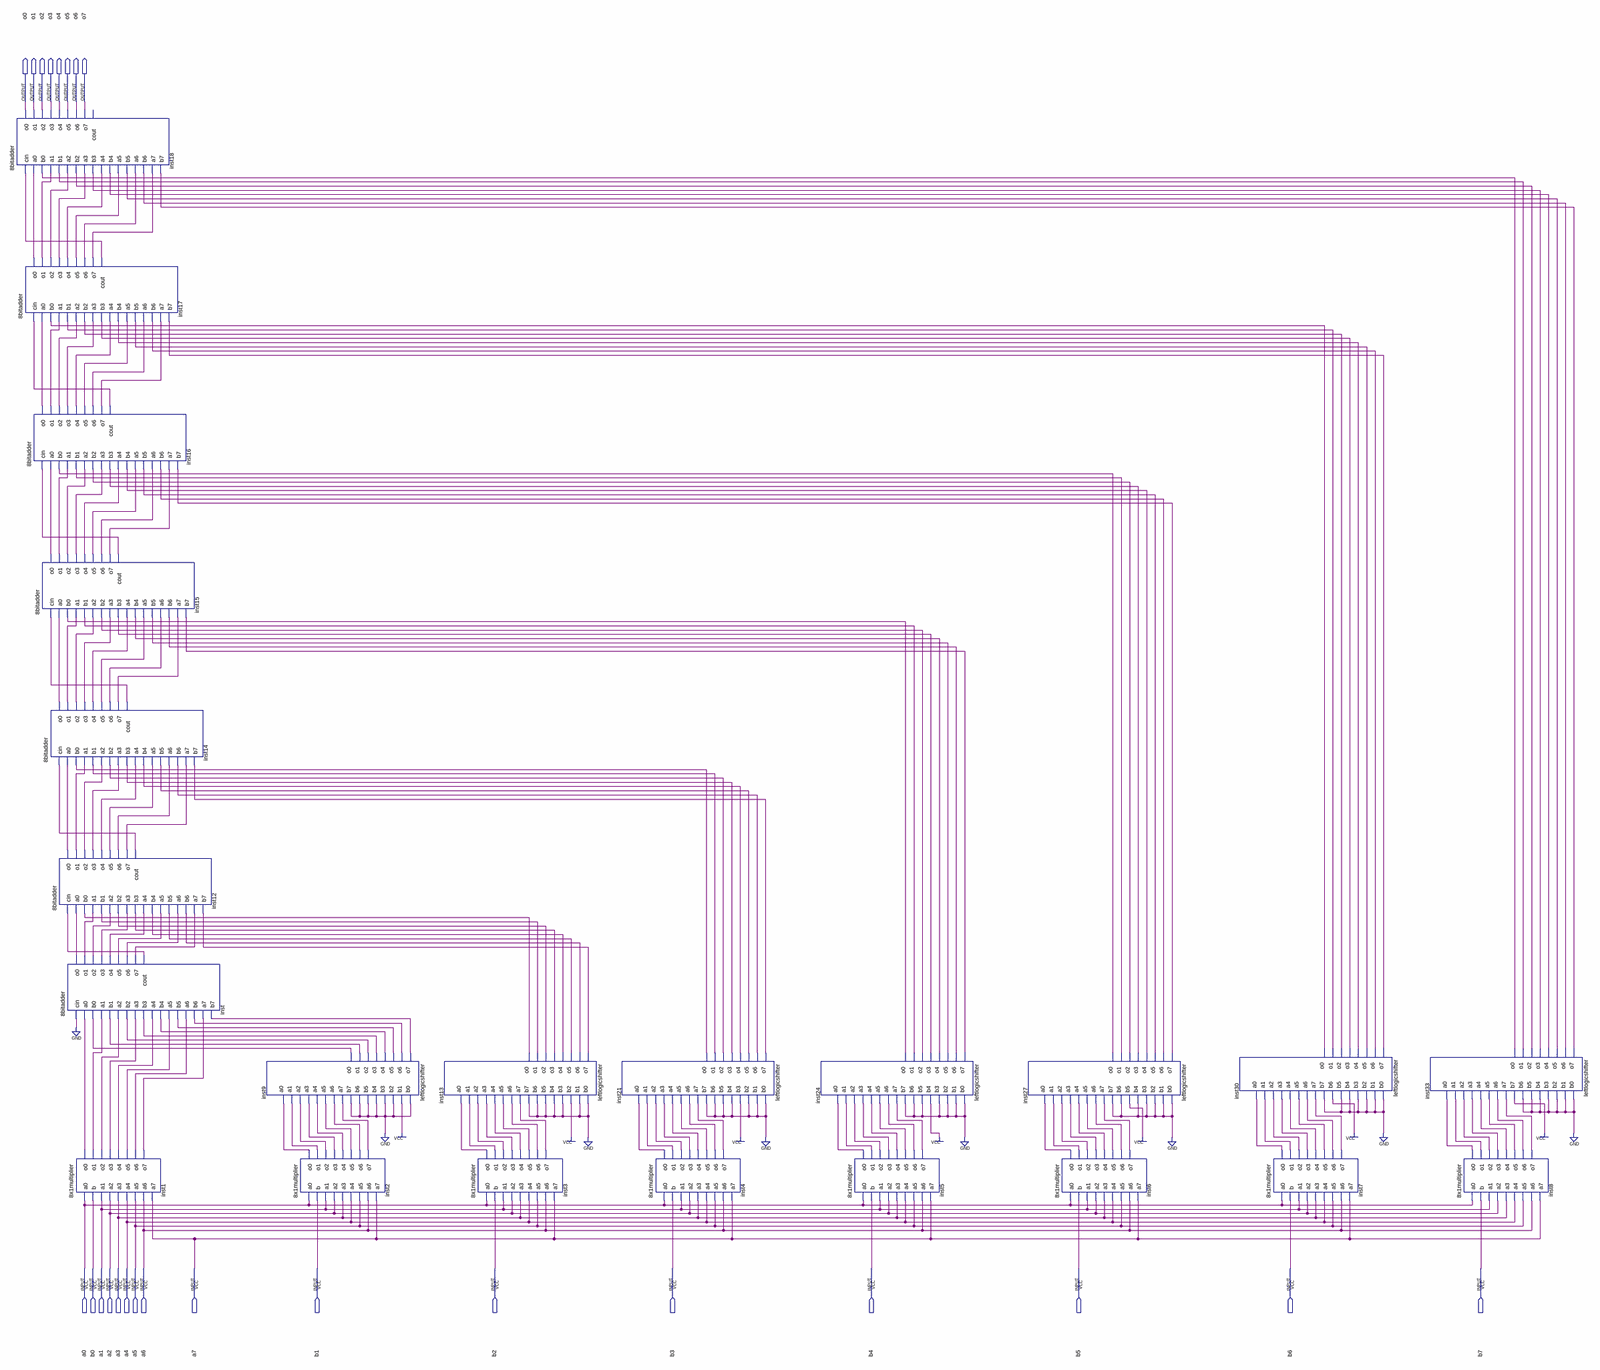
[diagram p0: schematic sheet, whole]
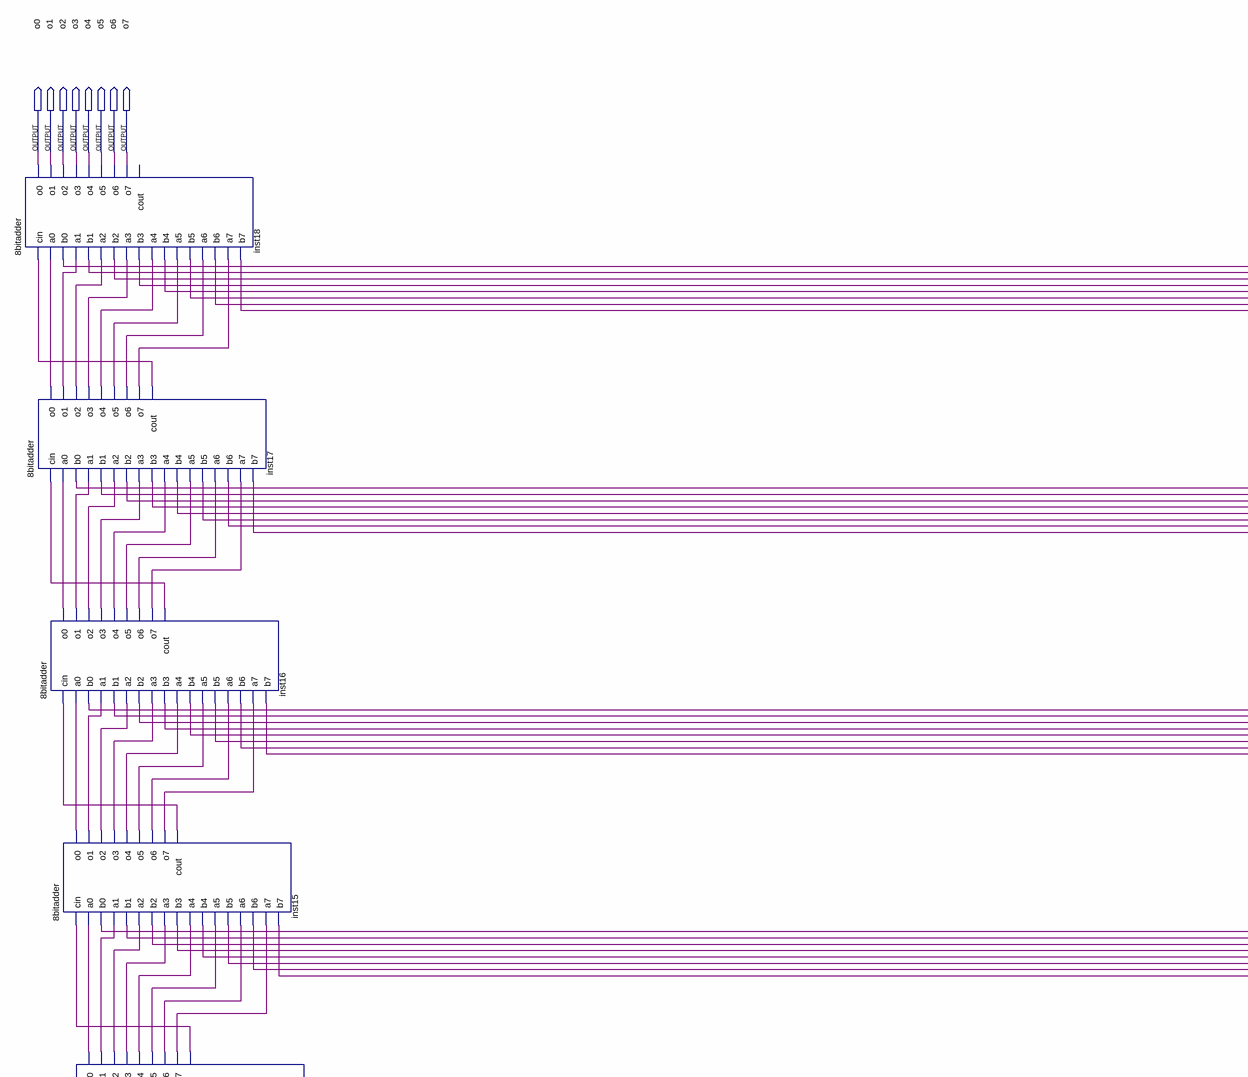
[diagram p1: schematic sheet, upper left part]
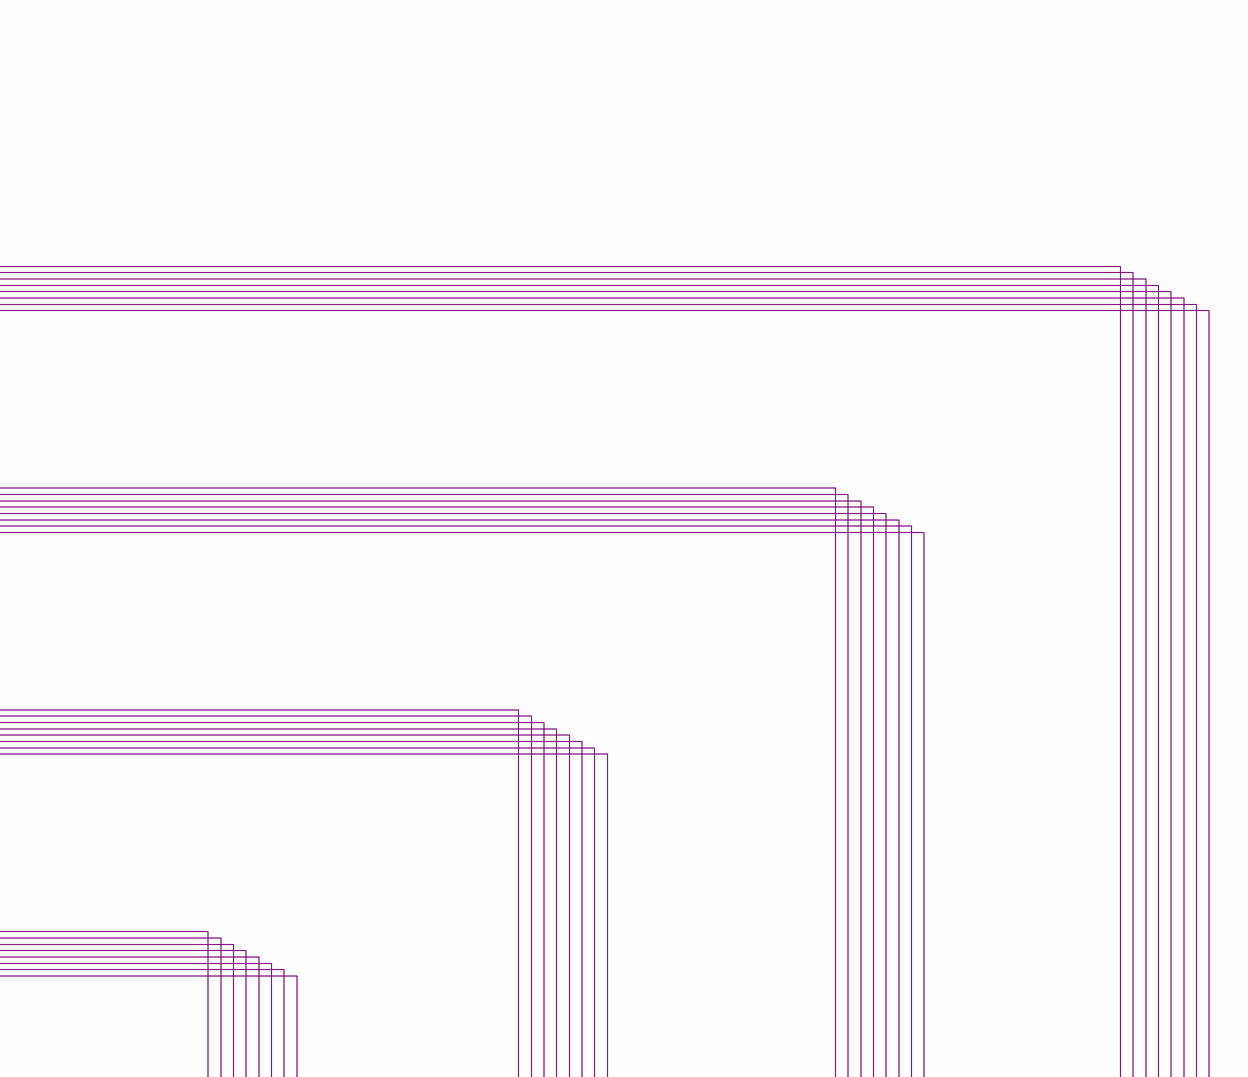
[diagram p2: schematic sheet, upper right part]
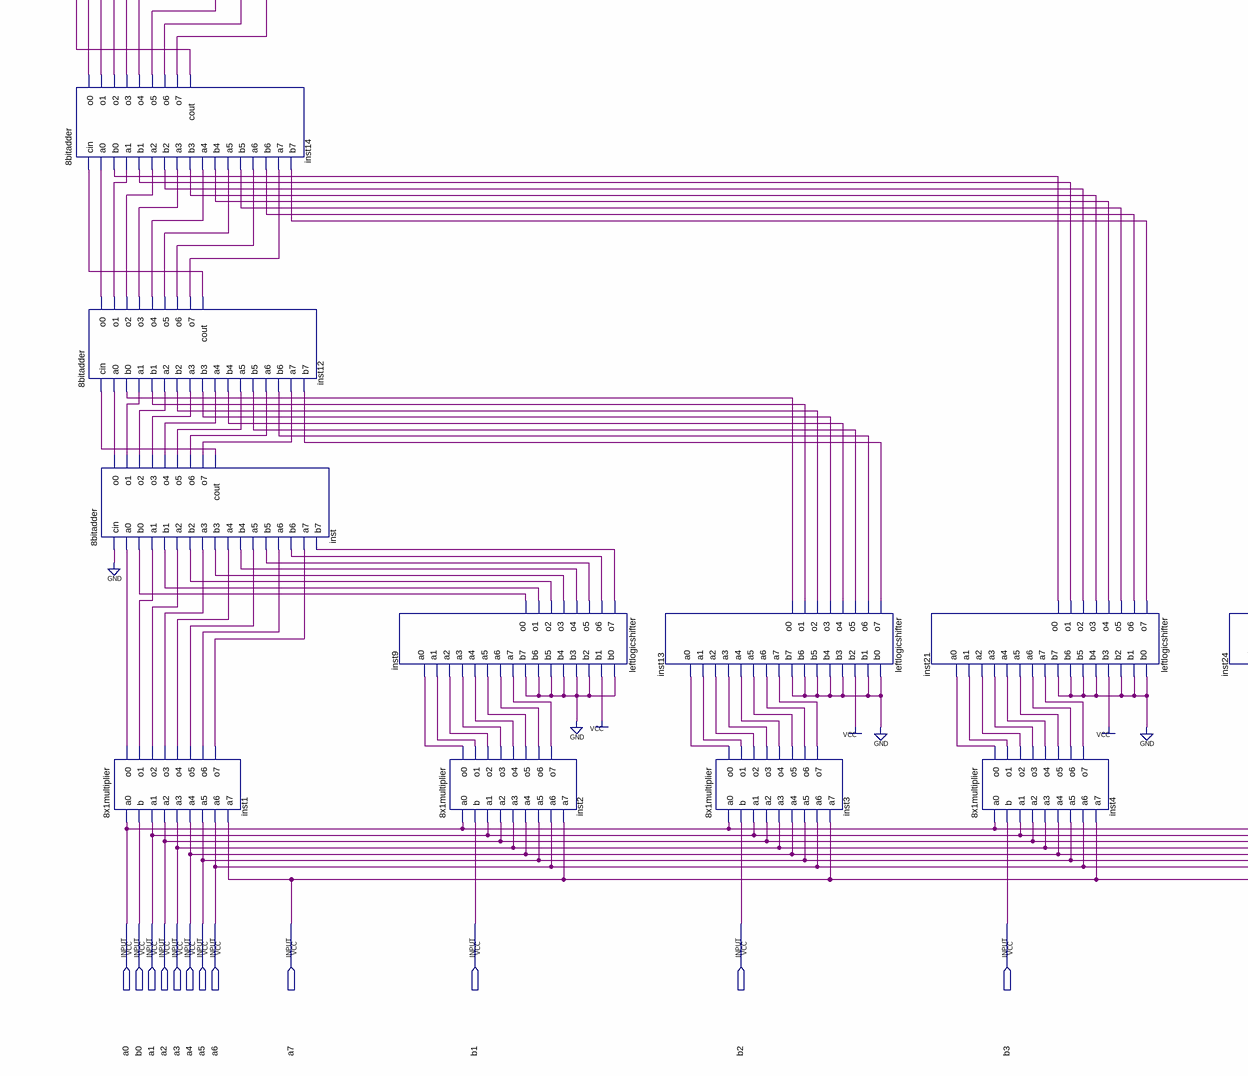
[diagram p3: schematic sheet, lower left part]
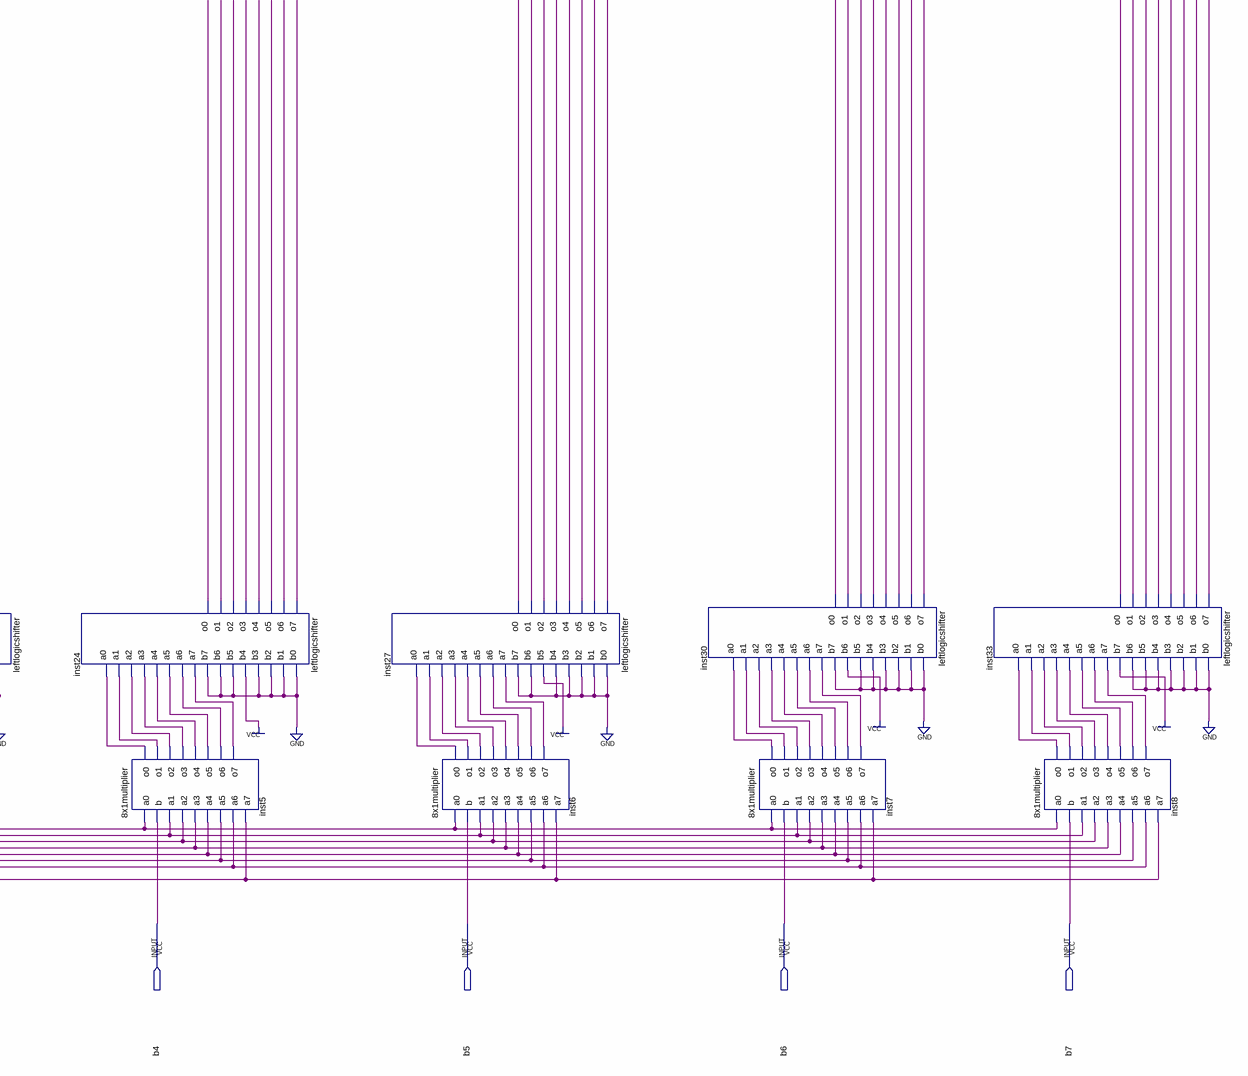
[diagram p4: schematic sheet, lower right part]
// Quartus schematic 8x8multiplier.bdf as structural Verilog: 22 symbols, 24 pins
module \8x8multiplier  (
  input  a0,
  input  b0,
  input  a1,
  input  a2,
  input  a3,
  input  a4,
  input  a5,
  input  a6,
  input  a7,
  input  b1,
  input  b2,
  input  b3,
  input  b4,
  input  b5,
  input  b6,
  input  b7,
  output o0,
  output o1,
  output o2,
  output o3,
  output o4,
  output o5,
  output o6,
  output o7
);

  wire inst1_o0, inst1_o1, inst1_o2, inst1_o3, inst1_o4, inst1_o5, inst1_o6, inst1_o7, inst2_o0, inst2_o1,
       inst2_o2, inst2_o3, inst2_o4, inst2_o5, inst2_o6, inst2_o7, inst3_o0, inst3_o1, inst3_o2, inst3_o3,
       inst3_o4, inst3_o5, inst3_o6, inst3_o7, inst4_o0, inst4_o1, inst4_o2, inst4_o3, inst4_o4, inst4_o5,
       inst4_o6, inst4_o7, inst5_o0, inst5_o1, inst5_o2, inst5_o3, inst5_o4, inst5_o5, inst5_o6, inst5_o7,
       inst6_o0, inst6_o1, inst6_o2, inst6_o3, inst6_o4, inst6_o5, inst6_o6, inst6_o7, inst7_o0, inst7_o1,
       inst7_o2, inst7_o3, inst7_o4, inst7_o5, inst7_o6, inst7_o7, inst8_o0, inst8_o1, inst8_o2, inst8_o3,
       inst8_o4, inst8_o5, inst8_o6, inst8_o7, inst9_o0, inst9_o1, inst9_o2, inst9_o3, inst9_o4, inst9_o5,
       inst9_o6, inst9_o7, inst12_cout, inst12_o0, inst12_o1, inst12_o2, inst12_o3, inst12_o4, inst12_o5,
       inst12_o6, inst12_o7, inst13_o0, inst13_o1, inst13_o2, inst13_o3, inst13_o4, inst13_o5, inst13_o6,
       inst13_o7, inst14_cout, inst14_o0, inst14_o1, inst14_o2, inst14_o3, inst14_o4, inst14_o5, inst14_o6,
       inst14_o7, inst15_cout, inst15_o0, inst15_o1, inst15_o2, inst15_o3, inst15_o4, inst15_o5, inst15_o6,
       inst15_o7, inst16_cout, inst16_o0, inst16_o1, inst16_o2, inst16_o3, inst16_o4, inst16_o5, inst16_o6,
       inst16_o7, inst17_cout, inst17_o0, inst17_o1, inst17_o2, inst17_o3, inst17_o4, inst17_o5, inst17_o6,
       inst17_o7, inst21_o0, inst21_o1, inst21_o2, inst21_o3, inst21_o4, inst21_o5, inst21_o6, inst21_o7,
       inst24_o0, inst24_o1, inst24_o2, inst24_o3, inst24_o4, inst24_o5, inst24_o6, inst24_o7, inst27_o0,
       inst27_o1, inst27_o2, inst27_o3, inst27_o4, inst27_o5, inst27_o6, inst27_o7, inst30_o0, inst30_o1,
       inst30_o2, inst30_o3, inst30_o4, inst30_o5, inst30_o6, inst30_o7, inst33_o0, inst33_o1, inst33_o2,
       inst33_o3, inst33_o4, inst33_o5, inst33_o6, inst33_o7, inst_cout, inst_o0, inst_o1, inst_o2, inst_o3,
       inst_o4, inst_o5, inst_o6, inst_o7;

  \8bitadder  inst18 (
    .cin(inst17_cout), .a0(inst17_o0), .b0(inst33_o0), .a1(inst17_o1), .b1(inst33_o1), .a2(inst17_o2),
    .b2(inst33_o2), .a3(inst17_o3), .b3(inst33_o3), .a4(inst17_o4), .b4(inst33_o4), .a5(inst17_o5),
    .b5(inst33_o5), .a6(inst17_o6), .b6(inst33_o6), .a7(inst17_o7), .b7(inst33_o7), .o0(o0), .o1(o1),
    .o2(o2), .o3(o3), .o4(o4), .o5(o5), .o6(o6), .o7(o7));  // open: cout
  \8bitadder  inst17 (
    .cin(inst16_cout), .a0(inst16_o0), .b0(inst30_o0), .a1(inst16_o1), .b1(inst30_o1), .a2(inst16_o2),
    .b2(inst30_o2), .a3(inst16_o3), .b3(inst30_o3), .a4(inst16_o4), .b4(inst30_o4), .a5(inst16_o5),
    .b5(inst30_o5), .a6(inst16_o6), .b6(inst30_o6), .a7(inst16_o7), .b7(inst30_o7), .o0(inst17_o0),
    .o1(inst17_o1), .o2(inst17_o2), .o3(inst17_o3), .o4(inst17_o4), .o5(inst17_o5), .o6(inst17_o6),
    .o7(inst17_o7), .cout(inst17_cout));
  \8bitadder  inst16 (
    .cin(inst15_cout), .a0(inst15_o0), .b0(inst27_o0), .a1(inst15_o1), .b1(inst27_o1), .a2(inst15_o2),
    .b2(inst27_o2), .a3(inst15_o3), .b3(inst27_o3), .a4(inst15_o4), .b4(inst27_o4), .a5(inst15_o5),
    .b5(inst27_o5), .a6(inst15_o6), .b6(inst27_o6), .a7(inst15_o7), .b7(inst27_o7), .o0(inst16_o0),
    .o1(inst16_o1), .o2(inst16_o2), .o3(inst16_o3), .o4(inst16_o4), .o5(inst16_o5), .o6(inst16_o6),
    .o7(inst16_o7), .cout(inst16_cout));
  \8bitadder  inst15 (
    .cin(inst14_cout), .a0(inst14_o0), .b0(inst24_o0), .a1(inst14_o1), .b1(inst24_o1), .a2(inst14_o2),
    .b2(inst24_o2), .a3(inst14_o3), .b3(inst24_o3), .a4(inst14_o4), .b4(inst24_o4), .a5(inst14_o5),
    .b5(inst24_o5), .a6(inst14_o6), .b6(inst24_o6), .a7(inst14_o7), .b7(inst24_o7), .o0(inst15_o0),
    .o1(inst15_o1), .o2(inst15_o2), .o3(inst15_o3), .o4(inst15_o4), .o5(inst15_o5), .o6(inst15_o6),
    .o7(inst15_o7), .cout(inst15_cout));
  \8bitadder  inst14 (
    .cin(inst12_cout), .a0(inst12_o0), .b0(inst21_o0), .a1(inst12_o1), .b1(inst21_o1), .a2(inst12_o2),
    .b2(inst21_o2), .a3(inst12_o3), .b3(inst21_o3), .a4(inst12_o4), .b4(inst21_o4), .a5(inst12_o5),
    .b5(inst21_o5), .a6(inst12_o6), .b6(inst21_o6), .a7(inst12_o7), .b7(inst21_o7), .o0(inst14_o0),
    .o1(inst14_o1), .o2(inst14_o2), .o3(inst14_o3), .o4(inst14_o4), .o5(inst14_o5), .o6(inst14_o6),
    .o7(inst14_o7), .cout(inst14_cout));
  \8bitadder  inst12 (
    .cin(inst_cout), .a0(inst_o0), .b0(inst13_o0), .a1(inst_o1), .b1(inst13_o1), .a2(inst_o2),
    .b2(inst13_o2), .a3(inst_o3), .b3(inst13_o3), .a4(inst_o4), .b4(inst13_o4), .a5(inst_o5), .b5(inst13_o5),
    .a6(inst_o6), .b6(inst13_o6), .a7(inst_o7), .b7(inst13_o7), .o0(inst12_o0), .o1(inst12_o1),
    .o2(inst12_o2), .o3(inst12_o3), .o4(inst12_o4), .o5(inst12_o5), .o6(inst12_o6), .o7(inst12_o7),
    .cout(inst12_cout));
  \8bitadder  inst (
    .cin(1'b0), .a0(inst1_o0), .b0(inst9_o0), .a1(inst1_o1), .b1(inst9_o1), .a2(inst1_o2), .b2(inst9_o2),
    .a3(inst1_o3), .b3(inst9_o3), .a4(inst1_o4), .b4(inst9_o4), .a5(inst1_o5), .b5(inst9_o5), .a6(inst1_o6),
    .b6(inst9_o6), .a7(inst1_o7), .b7(inst9_o7), .o0(inst_o0), .o1(inst_o1), .o2(inst_o2), .o3(inst_o3),
    .o4(inst_o4), .o5(inst_o5), .o6(inst_o6), .o7(inst_o7), .cout(inst_cout));
  \8x1multiplier  inst1 (
    .a0(a0), .b(b0), .a1(a1), .a2(a2), .a3(a3), .a4(a4), .a5(a5), .a6(a6), .a7(a7), .o0(inst1_o0),
    .o1(inst1_o1), .o2(inst1_o2), .o3(inst1_o3), .o4(inst1_o4), .o5(inst1_o5), .o6(inst1_o6), .o7(inst1_o7));
  leftlogicshifter inst9 (
    .b0(1'b0), .b1(1'b1), .b2(1'b0), .b3(1'b0), .b4(1'b0), .b5(1'b0), .b6(1'b0), .b7(1'b0), .a7(inst2_o7),
    .a6(inst2_o6), .a5(inst2_o5), .a4(inst2_o4), .a3(inst2_o3), .a2(inst2_o2), .a1(inst2_o1), .a0(inst2_o0),
    .o7(inst9_o7), .o6(inst9_o6), .o5(inst9_o5), .o4(inst9_o4), .o3(inst9_o3), .o2(inst9_o2), .o1(inst9_o1),
    .o0(inst9_o0));
  \8x1multiplier  inst2 (
    .a0(a0), .b(b1), .a1(a1), .a2(a2), .a3(a3), .a4(a4), .a5(a5), .a6(a6), .a7(a7), .o0(inst2_o0),
    .o1(inst2_o1), .o2(inst2_o2), .o3(inst2_o3), .o4(inst2_o4), .o5(inst2_o5), .o6(inst2_o6), .o7(inst2_o7));
  leftlogicshifter inst13 (
    .b0(1'b0), .b1(1'b0), .b2(1'b1), .b3(1'b0), .b4(1'b0), .b5(1'b0), .b6(1'b0), .b7(1'b0), .a7(inst3_o7),
    .a6(inst3_o6), .a5(inst3_o5), .a4(inst3_o4), .a3(inst3_o3), .a2(inst3_o2), .a1(inst3_o1), .a0(inst3_o0),
    .o7(inst13_o7), .o6(inst13_o6), .o5(inst13_o5), .o4(inst13_o4), .o3(inst13_o3), .o2(inst13_o2),
    .o1(inst13_o1), .o0(inst13_o0));
  \8x1multiplier  inst3 (
    .a0(a0), .b(b2), .a1(a1), .a2(a2), .a3(a3), .a4(a4), .a5(a5), .a6(a6), .a7(a7), .o0(inst3_o0),
    .o1(inst3_o1), .o2(inst3_o2), .o3(inst3_o3), .o4(inst3_o4), .o5(inst3_o5), .o6(inst3_o6), .o7(inst3_o7));
  leftlogicshifter inst21 (
    .b0(1'b0), .b1(1'b0), .b2(1'b0), .b3(1'b1), .b4(1'b0), .b5(1'b0), .b6(1'b0), .b7(1'b0), .a7(inst4_o7),
    .a6(inst4_o6), .a5(inst4_o5), .a4(inst4_o4), .a3(inst4_o3), .a2(inst4_o2), .a1(inst4_o1), .a0(inst4_o0),
    .o7(inst21_o7), .o6(inst21_o6), .o5(inst21_o5), .o4(inst21_o4), .o3(inst21_o3), .o2(inst21_o2),
    .o1(inst21_o1), .o0(inst21_o0));
  \8x1multiplier  inst4 (
    .a0(a0), .b(b3), .a1(a1), .a2(a2), .a3(a3), .a4(a4), .a5(a5), .a6(a6), .a7(a7), .o0(inst4_o0),
    .o1(inst4_o1), .o2(inst4_o2), .o3(inst4_o3), .o4(inst4_o4), .o5(inst4_o5), .o6(inst4_o6), .o7(inst4_o7));
  leftlogicshifter inst24 (
    .b0(1'b0), .b1(1'b0), .b2(1'b0), .b3(1'b0), .b4(1'b1), .b5(1'b0), .b6(1'b0), .b7(1'b0), .a7(inst5_o7),
    .a6(inst5_o6), .a5(inst5_o5), .a4(inst5_o4), .a3(inst5_o3), .a2(inst5_o2), .a1(inst5_o1), .a0(inst5_o0),
    .o7(inst24_o7), .o6(inst24_o6), .o5(inst24_o5), .o4(inst24_o4), .o3(inst24_o3), .o2(inst24_o2),
    .o1(inst24_o1), .o0(inst24_o0));
  \8x1multiplier  inst5 (
    .a0(a0), .b(b4), .a1(a1), .a2(a2), .a3(a3), .a4(a4), .a5(a5), .a6(a6), .a7(a7), .o0(inst5_o0),
    .o1(inst5_o1), .o2(inst5_o2), .o3(inst5_o3), .o4(inst5_o4), .o5(inst5_o5), .o6(inst5_o6), .o7(inst5_o7));
  leftlogicshifter inst27 (
    .b0(1'b0), .b1(1'b0), .b2(1'b0), .b3(1'b0), .b4(1'b0), .b5(1'b1), .b6(1'b0), .b7(1'b0), .a7(inst6_o7),
    .a6(inst6_o6), .a5(inst6_o5), .a4(inst6_o4), .a3(inst6_o3), .a2(inst6_o2), .a1(inst6_o1), .a0(inst6_o0),
    .o7(inst27_o7), .o6(inst27_o6), .o5(inst27_o5), .o4(inst27_o4), .o3(inst27_o3), .o2(inst27_o2),
    .o1(inst27_o1), .o0(inst27_o0));
  \8x1multiplier  inst6 (
    .a0(a0), .b(b5), .a1(a1), .a2(a2), .a3(a3), .a4(a4), .a5(a5), .a6(a6), .a7(a7), .o0(inst6_o0),
    .o1(inst6_o1), .o2(inst6_o2), .o3(inst6_o3), .o4(inst6_o4), .o5(inst6_o5), .o6(inst6_o6), .o7(inst6_o7));
  leftlogicshifter inst30 (
    .b0(1'b0), .b1(1'b0), .b2(1'b0), .b3(1'b0), .b4(1'b0), .b5(1'b0), .b6(1'b1), .b7(1'b0), .a7(inst7_o7),
    .a6(inst7_o6), .a5(inst7_o5), .a4(inst7_o4), .a3(inst7_o3), .a2(inst7_o2), .a1(inst7_o1), .a0(inst7_o0),
    .o7(inst30_o7), .o6(inst30_o6), .o5(inst30_o5), .o4(inst30_o4), .o3(inst30_o3), .o2(inst30_o2),
    .o1(inst30_o1), .o0(inst30_o0));
  \8x1multiplier  inst7 (
    .a0(a0), .b(b6), .a1(a1), .a2(a2), .a3(a3), .a4(a4), .a5(a5), .a6(a6), .a7(a7), .o0(inst7_o0),
    .o1(inst7_o1), .o2(inst7_o2), .o3(inst7_o3), .o4(inst7_o4), .o5(inst7_o5), .o6(inst7_o6), .o7(inst7_o7));
  leftlogicshifter inst33 (
    .b0(1'b0), .b1(1'b0), .b2(1'b0), .b3(1'b0), .b4(1'b0), .b5(1'b0), .b6(1'b0), .b7(1'b1), .a7(inst8_o7),
    .a6(inst8_o6), .a5(inst8_o5), .a4(inst8_o4), .a3(inst8_o3), .a2(inst8_o2), .a1(inst8_o1), .a0(inst8_o0),
    .o7(inst33_o7), .o6(inst33_o6), .o5(inst33_o5), .o4(inst33_o4), .o3(inst33_o3), .o2(inst33_o2),
    .o1(inst33_o1), .o0(inst33_o0));
  \8x1multiplier  inst8 (
    .a0(a0), .b(b7), .a1(a1), .a2(a2), .a3(a3), .a4(a4), .a5(a5), .a6(a6), .a7(a7), .o0(inst8_o0),
    .o1(inst8_o1), .o2(inst8_o2), .o3(inst8_o3), .o4(inst8_o4), .o5(inst8_o5), .o6(inst8_o6), .o7(inst8_o7));
endmodule
